# Altium schematic sheet Fuente.SchDoc
size A4; SheetNumber: 1; SheetTotal: 1; SPICEModelCachePMTCUZQZ: <root> / <DocumentId>PMTCUZQZ</DocumentId> / <CacheFrame Number="0"> / <Model Name="bridge" Kind="CKT"> / <Text>*Default Diode Bridge Rectifier / *Connections: / *              V- / *              | AC1 / *              | | V+ / *              | | | AC2 / *              | | | | / .SUBCKT BRIDGE 1 2 3 4 / D1 1 2 DMOD / D2 1 4 DMOD / D3 2 3 DMOD / D4 4 3 DMOD / .MODEL DMOD D () / .ENDS BRIDGE</Text> / </Model> / <Model Name="led2" Kind="MDL"> / <Text>*Typ RED,GREEN,YELLOW,AMBER GaAs LED: Vf=2.1V Vr=4V If=40mA trr=3uS / *LED Pinout: 1=A, 2=K / .MODEL LED2 D (IS=93.1P RS=42M N=4.61 BV=4 IBV=10U / + CJO=2.97P VJ=.75 M=.333 TT=4.32U)</Text> / </Model> / <Model Name="comphys_basic_gen" Kind="CKT"> / <Text>*$ / .SUBCKT COMPHYS_BASIC_GEN INP INM HYS OUT PARAMS: VDD=1 VSS=0 VTHRESH=0.5 / EIN INP1 INM1 INP INM 1 / EHYS INP1 INP2 VALUE { IF( V(1) &gt; {VTHRESH},-V(HYS),0) } / EOUT OUT 0 VALUE { IF( V(INP2)&gt;V(INM1), {VDD} ,{VSS}) } / R1 OUT 1 1 / C1 1 0 5n / RINP1 INP1 0 1K / .ENDS COMPHYS_BASIC_GEN</Text> / </Model> / <Model Name="lm1117_n_3p3_f1" Kind="CKT"> / <Text>*$ / **************************** / .subckt LM1117_N_3P3_F1 1 2 3 4 / F_F1         3 4 VF_F1 1 / VF_F1         1 2 0V / .ends LM1117_N_3P3_F1</Text> / </Model> / <Model Name="d_d" Kind="CKT"> / <Text>*$ / .subckt d_d 1 2 / d1 1 2 dd / .model dd d / + is=1e-015 / + n=0.01 / + tt=1e-011 / .ends d_d</Text> / </Model> / <Model Name="lm1117_n_3p3_s2" Kind="CKT"> / <Text>*$ / .subckt LM1117_N_3P3_S2 1 2 3 4 / S_S2         3 4 1 2 _S2 / RS_S2         1 2 1G / .MODEL         _S2 VSWITCH Roff=10k Ron=160 Voff=0.0V Von=1.0V / .ends LM1117_N_3P3_S2</Text> / </Model> / <Model Name="lm1117_n_3p3_trans" Kind="CKT"> / <Text>* PSpice Model Editor - Version 16.2.0 / *$ / * LM1117_N_3P3 / ***************************************************************************** / * (C) Copyright 2015 Texas Instruments Incorporated. All rights reserved. / ***************************************************************************** / ** This model is designed as an aid for customers of Texas Instruments. / ** TI and its licensors and suppliers make no warranties, either expressed / ** or implied, with respect to this model, including the warranties of / ** merchantability or fitness for a particular purpose. The model is / ** provided solely on an "as is" basis. The entire risk as to its quality / ** and performance is with the customer. / ***************************************************************************** / * / ** Released by: WEBENCH Design Center, Texas Instruments Inc. / * Part: LM1117_N_3P3 / * Date: 17MAR2015 / * Model Type: Transient / * Simulator: PSpice / * Simulator Version: 16.2.0.p001 / * EVM Order Number: / * EVM User's Guide: / * Data sheet: SNOS412M –FEBRUARY 2000–REVISED MARCH 2013 / * / * Model Version: Final 1.1 / * / ***************************************************************************** / * / * Updates: / * / * Final 1.00 / * Release to Web / * / ***************************************************************************** / .SUBCKT LM1117_N_3P3_TRANS IN OUT GND_0 GND_1 / .PARAM  psrr=177.83u uvlo=1.5 ilim=1.2 pole=2k zero=300k rinp=1e7 ttrn=180u / +  rout=1.5e-3 vref=1.25 ehys=0.11 drop=350m uhys=0.1 / R_R7         GND_0 GND_1  1m TC=0,0 / R_R6         N242982 VYY  10 TC=0,0 / C_U1_C2         0 U1_N05382  1n / E_U1_ABM4         U1_N09035 0 VALUE { V(U1_N05348) / + * (ABS(V(VZZ)) + 1e-6) / + / (ABS(V(N222934)) + 1e-6)  } / C_U1_C1         0 U1_N05348  {1e-6*SQRT(TTRN)} IC=0 / R_U1_R1         GND_0 U1_N05348  1G / X_U1_U2         IN U1_N352510 U1_N3524503 VIN_OK COMPHYS_BASIC_GEN PARAMS: / +  VDD=1 VSS=0 VTHRESH=0.5 / E_U1_E1         U1_DROP 0 TABLE { V(LOAD, 0) } / + ( (0,1) (100m, 1.1)(500m,1.14)(800m, 1.18) ) / V_U1_V3         U1_N3524503 0 {UHYS} / R_U1_R5         U1_N09745 N222524  10 TC=0,0 / V_U1_V4         U1_N352510 0 {UVLO} / R_U1_R3         U1_N08164 U1_N05348  {3.333e5*SQRT(TTRN)} TC=0,0 / C_U1_C3         0 N222524  1n / R_U1_R2         GND_0 U1_N05382  1G / E_U1_ABM6         U1_N08164 0 VALUE { IF(V(VIN_OK)&gt; 0.6, {VREF}, 0)    } / E_U1_ABM5         U1_N09745 0 VALUE { MIN(V(U1_N05382), / + MAX(V(IN) -V(U1_DROP), 0))   } / R_U1_R4         U1_N09035 U1_N05382  10 TC=0,0 / X_F1    N359447 VZZ N222604 VYY LM1117_N_3P3_F1 / R_R8         VIN_OK N398183  20 TC=0,0 / C_C3         0 VYY  1n / R_R5         N359447 VYY  {ROUT} / C_C4         0 N398183  1u / E_ABM1         N242982 0 VALUE { {MIN(V(VXX), (V(Vzz)+(ILIM*ROUT)))}    } / X_U2         0 OUT d_d PARAMS: / R_R1         VXX N222604  {RINP} / R_R2         N222524 VXX  {PSRR*RINP} / R_R3         GND_0 N222934  500k / X_S2    N398183 0 IN N222604 LM1117_N_3P3_S2 / C_C1         VXX N222604  {1/(6.28*RINP*POLE)} / R_R4         N222934 OUT  820k / E_ABM2         LOAD 0 VALUE { I(V_Vload)    } / C_C2         VXX N222524  {1/(6.28*PSRR*RINP*ZERO)} / C_C5         0 N222604  36n / V_Vload         VZZ OUT 0Vdc / .ENDS LM1117_N_3P3_TRANS</Text> / <Dependency>0\comphys_basic_gen</Dependency> / <Dependency>0\lm1117_n_3p3_f1</Dependency> / <Dependency>0\d_d</Dependency> / <Dependency>0\lm1117_n_3p3_s2</Dependency> / </Model> / <Model Name="lm7812" Kind="CKT"> / <Text>.SUBCKT LM7812  1    2    3 / QT6          23  10  2   Q_NPN 0.1 / QT7          5   4   10  Q_NPN 0.1 / QT5          7   6   5   Q_NPN 0.1 / QT1          1   9   8   Q_NPN 0.1 / QT3          11  8   7   Q_NPN 0.1 / QT2          11  13  12  Q_NPN 0.1 / QT17         1   15  14  Q_NPN 10 / C2           10  23      4P / R16          12  5       500 / R12          16  2       12.1K / QT18         17  23  16  Q_NPN 0.1 / D1           18  19  	 D_D / R11          20  21      850 / R5           22  3       100 / QT14         24  18  2   Q_NPN 0.1 / R21          6   2       2.67K / R20          3   6       5.22K / DZ2          25  26      D_5V1 / R19          1   26      16K / R18          14  3       250M / R17          25  14      380 / R15          25  15      1.62K / QT16         1   20  15  Q_NPN 1 / QT15         2   24  21  Q_PNP 0.1 / *OFF / R14          21  24      4K / C1           27  24      20P / R13          19  2       4K / QT13         24  27  18  Q_NPN 0.1 / QT12         20  25  22  Q_NPN 1 / *OFF / QT11         20  28  2   Q_NPN 0.1 / *OFF / QT10         20  11  1   Q_PNP 0.1 / R10          17  27      16.5K / R9           5   4       1.9K / R8           4   23      26 / R7           10  2       1.2K / R6           29  2       1K / QT9          11  11  1   Q_PNP 0.1 / QT8          27  16  29  Q_NPN 0.1 / QT4          15  6   17  Q_NPN 0.1 / DZ1          2   9       D_5V6 / R4           1   9       80K / R3           28  2       830 / R2           13  28      4.97K / R1           8   13      7K / .MODEL D_5V1 D( IS=10F N=1.16 BV=5.1 IBV=0.5M CJ0 = 1P TT = 10p ) / .MODEL D_5V6 D( IS=10F N=1.16 BV=5.6 IBV=5U CJ0 = 1P TT = 10p ) / .MODEL Q_NPN NPN( IS=10F NF=1.16 NR=1.16 BF=80 CJC=1P CJE=2P / +       TF=10P TR=1N ) / .MODEL Q_PNP PNP( IS=10F NF=1.16 NR=1.16 BF=80 CJC=1P CJE=2P / +      TF=10P TR=1N ) / .MODEL D_D D( IS=1F N=1.16 CJ0 = 1P TT = 10p ) / .ENDS LM7812</Text> / </Model> / <Model Name="lm7805" Kind="CKT"> / <Text>.SUBCKT LM7805  1    2    3 / * In GND Out / QT6          23  10  2   Q_NPN 0.1 / QT7          5   4   10  Q_NPN 0.1 / QT5          7   6   5   Q_NPN 0.1 / QT1          1   9   8   Q_NPN 0.1 / QT3          11  8   7   Q_NPN 0.1 / QT2          11  13  12  Q_NPN 0.1 / QT17         1   15  14  Q_NPN 10 / C2           10  23      4P / R16          12  5       500 / R12          16  2       12.1K / QT18         17  23  16  Q_NPN 0.1 / D1           18  19  	 D_D / R11          20  21      850 / R5           22  3       100 / QT14         24  18  2   Q_NPN 0.1 / R21          6   2       2.67K / R20          3   6       640 / DZ2          25  26      D_5V1 / R19          1   26      16K / R18          14  3       250M / R17          25  14      380 / R15          25  15      1.62K / QT16         1   20  15  Q_NPN 1 / QT15         2   24  21  Q_PNP 0.1 / *OFF / R14          21  24      4K / C1           27  24      20P / R13          19  2       4K / QT13         24  27  18  Q_NPN 0.1 / QT12         20  25  22  Q_NPN 1 / *OFF / QT11         20  28  2   Q_NPN 0.1 / *OFF / QT10         20  11  1   Q_PNP 0.1 / R10          17  27      16.5K / R9           5   4       1.9K / R8           4   23      26 / R7           10  2       1.2K / R6           29  2       1K / QT9          11  11  1   Q_PNP 0.1 / QT8          27  16  29  Q_NPN 0.1 / QT4          15  6   17  Q_NPN 0.1 / DZ1          2   9       D_5V6 / R4           1   9       80K / R3           28  2       830 / R2           13  28      4.97K / R1           8   13      7K / .MODEL D_5V1 D( IS=10F N=1.16 BV=5.1 IBV=0.5M CJ0 = 1P TT = 10p ) / .MODEL D_5V6 D( IS=10F N=1.16 BV=5.6 IBV=5U CJ0 = 1P TT = 10p ) / .MODEL Q_NPN NPN( IS=10F NF=1.16 NR=1.16 BF=80 CJC=1P CJE=2P / +       TF=10P TR=1N ) / .MODEL Q_PNP PNP( IS=10F NF=1.16 NR=1.16 BF=80 CJC=1P CJE=2P / +      TF=10P TR=1N ) / .MODEL D_D D( IS=1F N=1.16 CJ0 = 1P TT = 10p ) / .ENDS LM7805</Text> / </Model> / <Model Name="lm317" Kind="CKT"> / <Text>.SUBCKT LM317    1    2    3 / D4            4   3  D_Z6V0 / D3            5   6  D_Z6V3 / D2            7   1  D_Z6V3 / D1            3   8  D_Z6V3 / QT26          1  10   9  Q_NPN 20.0 / QT25          1  11  10  Q_NPN 2.0 / QT24_2       13  12   5  Q_NPN 0.1 / QT24         13  12  14  Q_NPN 0.1 / QT23         17  16  15  Q_NPN 1.0 / QT21         19  18   3  Q_NPN 0.1 / QT19         21   3  20  Q_NPN 1.0 / QT17         23   3  22  Q_NPN 0.1 / QT13          1  25  24  Q_NPN 0.1 / QT11         16  27  26  Q_NPN 0.1 / QT7          30  29  28  Q_NPN 0.1 / QT5          29  31   3  Q_NPN 0.1 / QT3          33  31  32  Q_NPN 0.1 / QT22_2       17  17   1  Q_PNP 1.0 / QT22         16  17   1  Q_PNP 1.0 / QT20          3  19  16  Q_PNP 0.1 / QT18         21  21  16  Q_PNP 0.1 / QT16         23  21  16  Q_PNP 0.1 / QT15          3  23  25  Q_PNP 0.1 / QT12          3  24  16  Q_PNP 0.1 / QT9          27  30  34  Q_PNP 0.1 / QT6           3  29  34  Q_PNP 0.1 / QT14         25  33  35  Q_PNP 0.1 / QT10         16  33  36  Q_PNP 0.1 / QT8          34  33  37  Q_PNP 0.1 / QT4          31  33  38  Q_PNP 0.1 / QT2          33  33  39  Q_PNP 0.1 / R27           4   2  50 / R26           9   3  100M / R25           9  14  2 / R24           5  14  160 / R23           7   6  18K / R22          10   3  160 / R21          12  13  400 / R20          18  13  13K / R19          16  11  370 / R18          15  10  130 / R17          16  12  12K / C3           19  18  5P / R16          16  19  6.7K / R15          20  22  2.4K / R14          22   4  12K / C2           23   4  30P / C1           23   3  30P / R13          24   3  5.1K / R12          26   3  72 / R11          27   3  5.8K / R10          28   3  4.1K / R9           32   3  180 / R8           34  30  12.4K / R7           31  29  130 / R6            8  31  100K / R5            1  35  5.6K / R4            1  36  82 / R3            1  37  190 / R2            1  38  310 / R1            1  39  310 / JT1           1   3   8  J_N / .MODEL D_Z6V0 D( IS=10F N=1.04 BV=6.0 IBV=1M CJ0 = 1P TT = 10p ) / .MODEL D_Z6V3 D( IS=10F N=1.04 BV=6.3 IBV=1M CJ0 = 1P TT = 10p ) / .MODEL Q_NPN NPN( IS=10F NF=1.04 NR=1.04 BF=100 CJC=1P CJE=2P / +       TF=10P TR=1N VAF=90) / .MODEL Q_PNP PNP( IS=10F NF=1.04 NR=1.04 BF=50 CJC=1P CJE=2P / +      TF=10P TR=1N VAF=45) / .MODEL J_N NJF( VTO=-7 ) / .ENDS LM117</Text> / </Model> / </CacheFrame> / <CacheFrame Number="1"> / <Model Name="fuse" Kind="CKT"> / <Text>.SUBCKT FUSE 1 2 PARAMS: CURRENT=3.15 RESISTANCE=1m / SW1 1 2 3 0 SMOD OFF / BNLV 3 0 V=(abs(v(1,2))) / .MODEL SMOD SW (VT={(CURRENT*RESISTANCE)} RON=1g ROFF={RESISTANCE}) / .ENDS FUSE</Text> / </Model> / </CacheFrame> / </root>
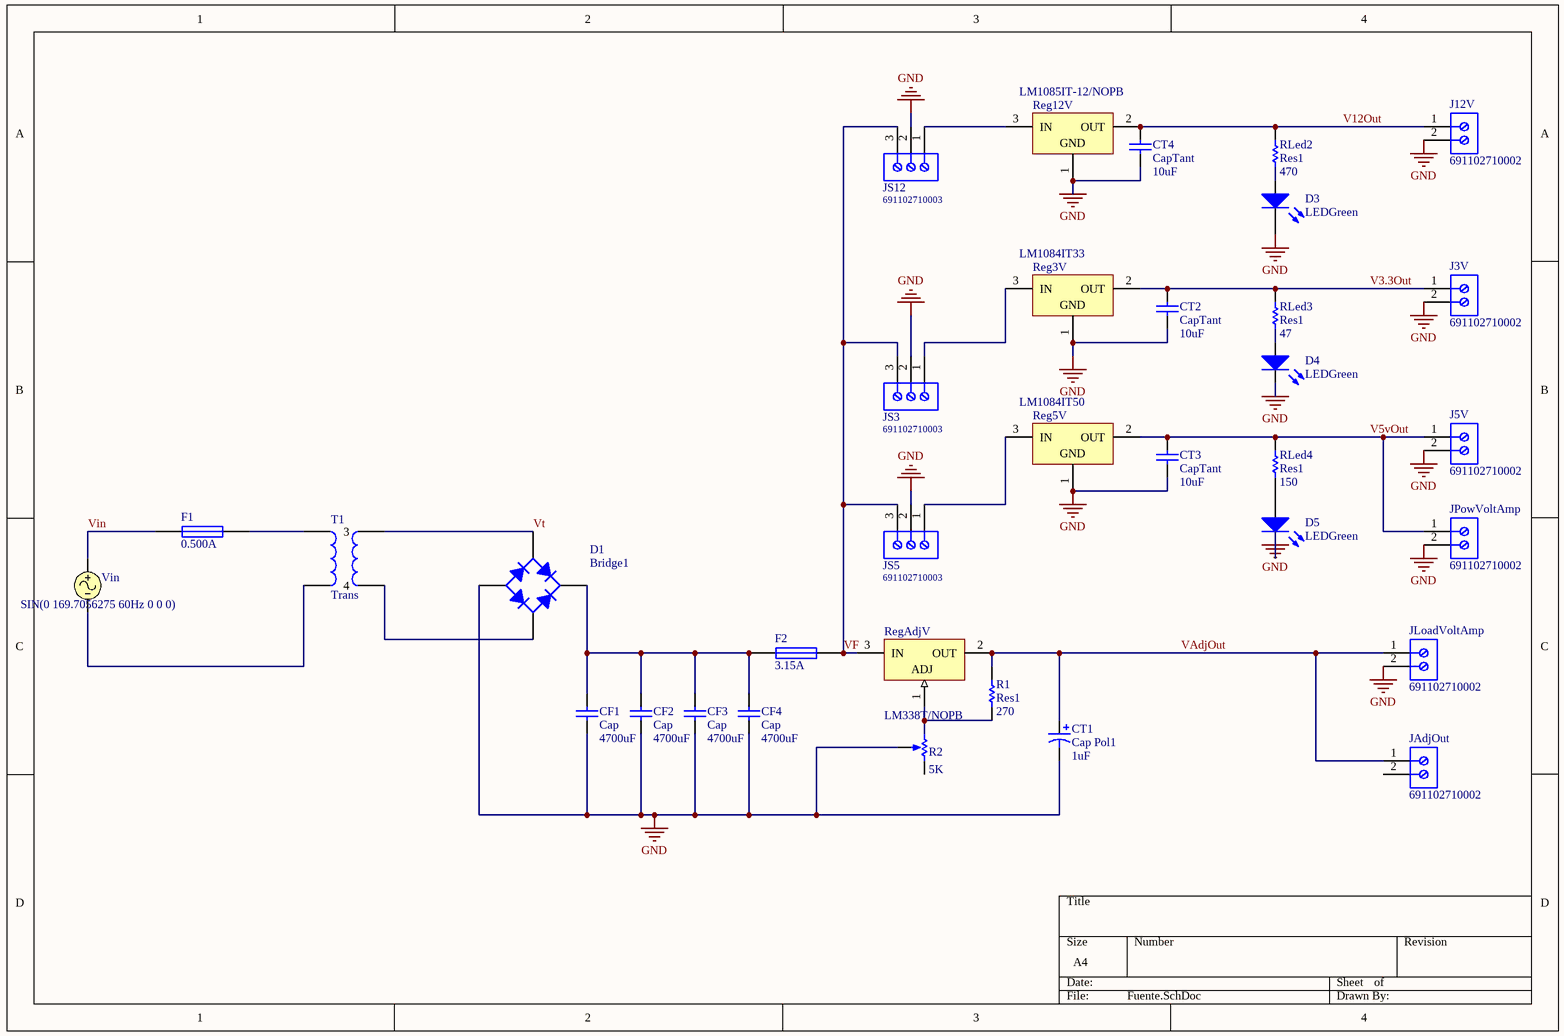
[diagram p0: Fuente.SchDoc]

## Parts
CF1  Cap  value 4700uF  [4700uF]
CF2  Cap  value 4700uF  [4700uF]
CF3  Cap  value 4700uF  [4700uF]
CF4  Cap  value 4700uF  [4700uF]
CT1  Cap Pol1  value 1uF  [CAPPRD200W50D500H1250]
CT2  CapTant  value 10uF  [RAD-0.3]
CT3  CapTant  value 10uF  [RAD-0.3]
CT4  CapTant  value 10uF  [RAD-0.3]
D1  Bridge1  [DIOB_GBJ2510]
D3  LEDGreen  [LEDRD254W57D500H1070]
D4  LEDGreen  [LEDRD254W57D500H1070]
D5  LEDGreen  [LEDRD254W57D500H1070]
F1  0.500A  [PIN-W2/E2.8]
F2  3.15A  [PIN-W2/E2.8]
J3V  691102710002  [691102710002]
J5V  691102710002  [691102710002]
J12V  691102710002  [691102710002]
JAdjOut  691102710002  [691102710002]
JLoadVoltAmp  691102710002  [691102710002]
JPowVoltAmp  691102710002  [691102710002]
JS3  691102710003  [691102710003]
JS5  691102710003  [691102710003]
JS12  691102710003  [691102710003]
R1  Res1  value 270  [AXIAL-0.3]
R2  value 5K  (hidden comment: Potentiometer)
Reg3V  LM1084IT33  [NDE0003A]
Reg5V  LM1084IT50  [NDE0003A]
Reg12V  LM1085IT-12/NOPB  [NDE0003A]
RegAdjV  LM338T/NOPB  [NDE0003A]
RLed2  Res1  value 470  [AXIAL-0.3]
RLed3  Res1  value 47  [AXIAL-0.3]
RLed4  Res1  value 150  [AXIAL-0.3]
T1  Trans  [691102710002]
Vin  SIN(0 169.7056275 60Hz 0 0 0)

## Nets
GND: CF1.1 CF2.1 CF3.1 CF4.1 CT1.2 CT2.1 CT3.1 CT4.1 D1.3(A) D3.2(K) D4.2(K) D5.2(K) J3V.2 J5V.2 J12V.2 JLoadVoltAmp.2 JPowVoltAmp.2 JS3.2 JS5.2 JS12.2 R2.3(TAP) Reg3V.1(GND) Reg5V.1(GND) Reg12V.1(GND)
V3.3Out: CT2.2 J3V.1 Reg3V.2(OUT) RLed3.2
V5vOut: CT3.2 J5V.1 JPowVoltAmp.1 Reg5V.2(OUT) RLed4.2
V12Out: CT4.2 J12V.1 Reg12V.2(OUT) RLed2.2
VAdjOut: CT1.1 JAdjOut.1 JLoadVoltAmp.1 R1.2 RegAdjV.2(OUT)
VF: F2.2 JS3.3 JS5.3 JS12.3 RegAdjV.3(IN)
Vin: F1.1 Vin.1
Vt: D1.4(C) T1.3
NetCF1_2: CF1.2 CF2.2 CF3.2 CF4.2 D1.1(K) F2.1
NetD1_2: D1.2(C) T1.4
NetD3_1: D3.1(A) RLed2.1
NetD4_1: D4.1(A) RLed3.1
NetD5_1: D5.1(A) RLed4.1
NetF1_2: F1.2 T1.1
NetJS3_1: JS3.1 Reg3V.3(IN)
NetJS5_1: JS5.1 Reg5V.3(IN)
NetJS12_1: JS12.1 Reg12V.3(IN)
NetR1_1: R1.1 R2.1(TOP) RegAdjV.1(ADJ)
NetT1_2: T1.2 Vin.2

Not connected (* = marked no-connect by the designer): JAdjOut 2; R2 2(BOT)

## Library data of the parts
CF1-CF4 = Cap: Capacitor; pin to pad: 1>NEG 2>POS; Published: 8-Jun-2000; LatestRevisionDate: 17-Jul-2002; LatestRevisionNote: Re-released for DXP Platform.; PackageReference: RAD-0.3; Publisher: Altium Limited; PackageDescription: Radial Cap, Thru-Hole; 2 Leads; 0.3 in Pin Spacing
CT1 = Cap Pol1: Polarized Capacitor (Radial); pin to pad: 1>P 2>N; Published: 8-Jun-2000; LatestRevisionDate: 17-Jul-2002; LatestRevisionNote: Re-released for DXP Platform.; PackageReference: RB7.6-15; Publisher: Altium Limited; PackageDescription: Polarized Capacitor (Radial); 2 Leads
CT2-CT4 = Cap: Capacitor; Published: 8-Jun-2000; LatestRevisionDate: 17-Jul-2002; LatestRevisionNote: Re-released for DXP Platform.; PackageReference: RAD-0.3; Publisher: Altium Limited; PackageDescription: Radial Cap, Thru-Hole; 2 Leads; 0.3 in Pin Spacing
D1 = Bridge1: Full Wave Diode Bridge; pin to pad: 2>3 3>4 4>2; Published: 8-Jun-2000; LatestRevisionDate: 29-May-2009; LatestRevisionNote: Sch pins A & K swapped.; DatasheetVersion: E2732B; PackageReference: D-38; Publisher: Altium Limited; PackageDescription: Bridge Rectifier; 4 Terminals; Body 9.4 x 9.4 mm (typ); Pitch 5.08 mm
D3-D5 = LED2: Typical RED, GREEN, YELLOW, AMBER GaAs LED; pin to pad: 1>A 2>C; Published: 8-Jun-2000; LatestRevisionDate: 17-Jul-2002; LatestRevisionNote: Re-released for DXP Platform.; PackageVersion: Feb-2002; PackageReference: 3.2X1.6X1.1; Publisher: Altium Limited; PackageDescription: SM LED; 2 Flat Leads
F1 = Fuse 1: Fuse; Published: 8-Jun-2000; LatestRevisionDate: 17-Jul-2002; LatestRevisionNote: Re-released for DXP Platform.; PackageReference: PIN-W2/E2.8; Publisher: Altium Limited; PackageDescription: Thru-Hole; 2 Leads
F2 = Fuse 1: Published: 8-Jun-2000; LatestRevisionDate: 17-Jul-2002; LatestRevisionNote: Re-released for DXP Platform.; PackageReference: PIN-W2/E2.8; Publisher: Altium Limited; PackageDescription: Thru-Hole; 2 Leads
J3V J5V J12V JAdjOut JLoadVoltAmp JPowVoltAmp = CMP-1502-03258-1: Series 102 - 5.00 mm Horizontal Entry Modular with Pressure Clamp WR-TBL, 2 pin; Manufacturer: Wurth Elektronik; Pin Number: 2; Pitch: 5.00mm; Manufacturer URL: http://www.we-online.de; Mounting Technology: THT; Publisher: WurthElektronik; Packaging: Box; Package Reference: 691102710002; Datasheet URL: http://katalog.we-online.de/em/datasheet/6911027100xx.pdf; Operating Temperature: -40to105degC; Part Number: 691102710002
JS3 JS5 JS12 = CMP-1502-03259-1: Series 102 - 5.00 mm Horizontal Entry Modular with Pressure Clamp WR-TBL, 3 pin; Manufacturer: Wurth Elektronik; Pitch: 5.00mm; Pin Number: 3; Operating Temperature: -40to105degC; Package Reference: 691102710003; Publisher: WurthElektronik; Datasheet URL: http://katalog.we-online.de/em/datasheet/6911027100xx.pdf; Manufacturer URL: http://www.we-online.de; Part Number: 691102710003; Mounting Technology: THT; Packaging: Box
R1 RLed2-RLed4 = Res1: Resistor; Published: 8-Jun-2000; LatestRevisionDate: 17-Jul-2002; LatestRevisionNote: Re-released for DXP Platform.; PackageReference: AXIAL-0.3; Publisher: Altium Limited; PackageDescription: Axial Device, Thru-Hole; 2 Leads; 0.3 in Pin Spacing
R2 = Potentiometer: position: 0.163; SimulationGenericComponent: True
Reg3V = CMP-0062-02533-3: 5A Low Dropout Positive Regulators, 3-pin TO-220, Pb-Free; Manufacturer: Texas Instruments; PowerWise: N; PackageTopMarking: NSUZXYTTE#*LM1084*IT-3.3; CompType: LDO IC; ComponentLink1Description: Datasheet URL; PackageReference: NDE0003A; PinCount: 3; RoHS: Y; ComponentLink1URL: http://www.ti.com/general/docs/lit/getliterature.tsp?genericPartNumber=LM1084&fileType=pdf; PackageDescription: TO-220, Molded, 3 Lead, Straight
Reg5V = CMP-0062-02537-3: 5A Low Dropout Positive Regulators, 3-pin TO-220, Pb-Free; Manufacturer: Texas Instruments; PowerWise: N; PackageTopMarking: NSUZXYTTE#*LM1084*IT-5.0; CompType: LDO IC; PackageDescription: TO-220, Molded, 3 Lead, Straight; ComponentLink1URL: http://www.ti.com/general/docs/lit/getliterature.tsp?genericPartNumber=LM1084&fileType=pdf; PackageReference: NDE0003A; RoHS: Y; PinCount: 3; ComponentLink1Description: Datasheet URL
Reg12V = CMP-0062-02530-3: 3A Low Dropout Positive Regulators, 3-pin TO-220, Pb-Free; Manufacturer: Texas Instruments; PowerWise: N; PackageTopMarking: NSUZXYTTE#*LM1085*IT-12; CompType: LDO IC; RoHS: Y; ComponentLink1URL: http://www.ti.com/general/docs/lit/getliterature.tsp?genericPartNumber=LM1085&fileType=pdf; PackageReference: NDE0003A; ComponentLink1Description: Datasheet URL; PinCount: 3; PackageDescription: TO-220, Molded, 3 Lead, Straight
RegAdjV = CMP-0062-02474-3: 5 Amp Adjustable Regulator, 3-pin TO-220, Pb-Free; Manufacturer: Texas Instruments; PackageTopMarking: NSUZXYTTE#*LM338T P+; CompType: LDO IC; PowerWise: N; ComponentLink1URL: http://www.ti.com/general/docs/lit/getliterature.tsp?genericPartNumber=LM338&fileType=pdf; ComponentLink1Description: Datasheet URL; RoHS: Y; PinCount: 3; PackageReference: NDE0003A; PackageDescription: TO-220, Molded, 3 Lead, Straight
T1 = Trans: Transformer; pin to pad: 1>none 2>none 3>1 4>2; Published: 24-Mar-1999; LatestRevisionDate: 08-Jul-2005; LatestRevisionNote: Mech Layer 1 removed.; PackageReference: TRANS; Publisher: Altium Limited; PackageDescription: Transformer; 4 Leads
Vin = VSIN: Sinusoidal Voltage Source; Note: PCB Footprint - Not required; Offset: 0; AC Magnitude: 1; Published: 8-Jun-2000; LatestRevisionDate: 15-Nov-2004; LatestRevisionNote: Corrected Netlist.; PackageReference: Not Applicable; Publisher: Altium Limited; Amplitude: 169.7056275; Frequency: 60Hz; Delay: 0; Damping Factor: 0; Phase: 0; DC Magnitude: 0; AC Phase: 0